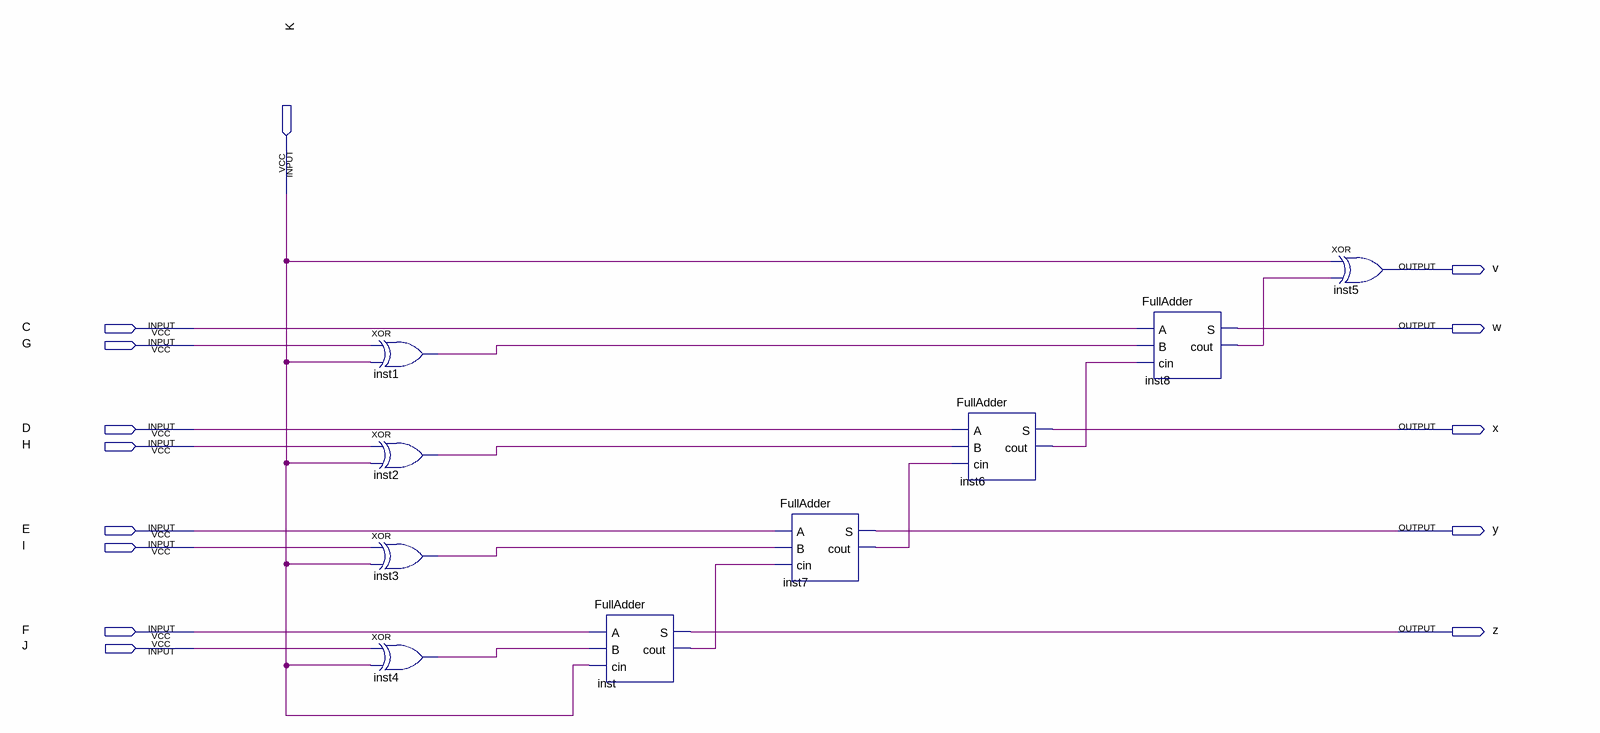
[diagram p0: schematic sheet]
// Quartus schematic Lab2.bdf as structural Verilog: 9 symbols, 14 pins
module Lab2 (
  input  K,
  input  C,
  input  G,
  input  D,
  input  H,
  input  E,
  input  I,
  input  F,
  input  J,
  output v,
  output w,
  output x,
  output y,
  output z
);

  wire inst1_out, inst2_out, inst3_out, inst4_out, inst6_cout, inst7_cout, inst8_cout, inst_cout;

  xor inst1 (inst1_out, G, K);
  xor inst2 (inst2_out, H, K);
  xor inst3 (inst3_out, I, K);
  xor inst4 (inst4_out, J, K);
  FullAdder inst (.A(F), .B(inst4_out), .cin(K), .S(z), .cout(inst_cout));
  FullAdder inst7 (.A(E), .B(inst3_out), .cin(inst_cout), .S(y), .cout(inst7_cout));
  FullAdder inst6 (.A(D), .B(inst2_out), .cin(inst7_cout), .S(x), .cout(inst6_cout));
  FullAdder inst8 (.A(C), .B(inst1_out), .cin(inst6_cout), .S(w), .cout(inst8_cout));
  xor inst5 (v, K, inst8_cout);
endmodule
